# EasyEDA schematic Lab01_2020-10-19_17-25-14.json
TITLE: Sheet_1; REV: 1.0; Date: 2020-10-19; Sheet: 1/1; Company: Your Company
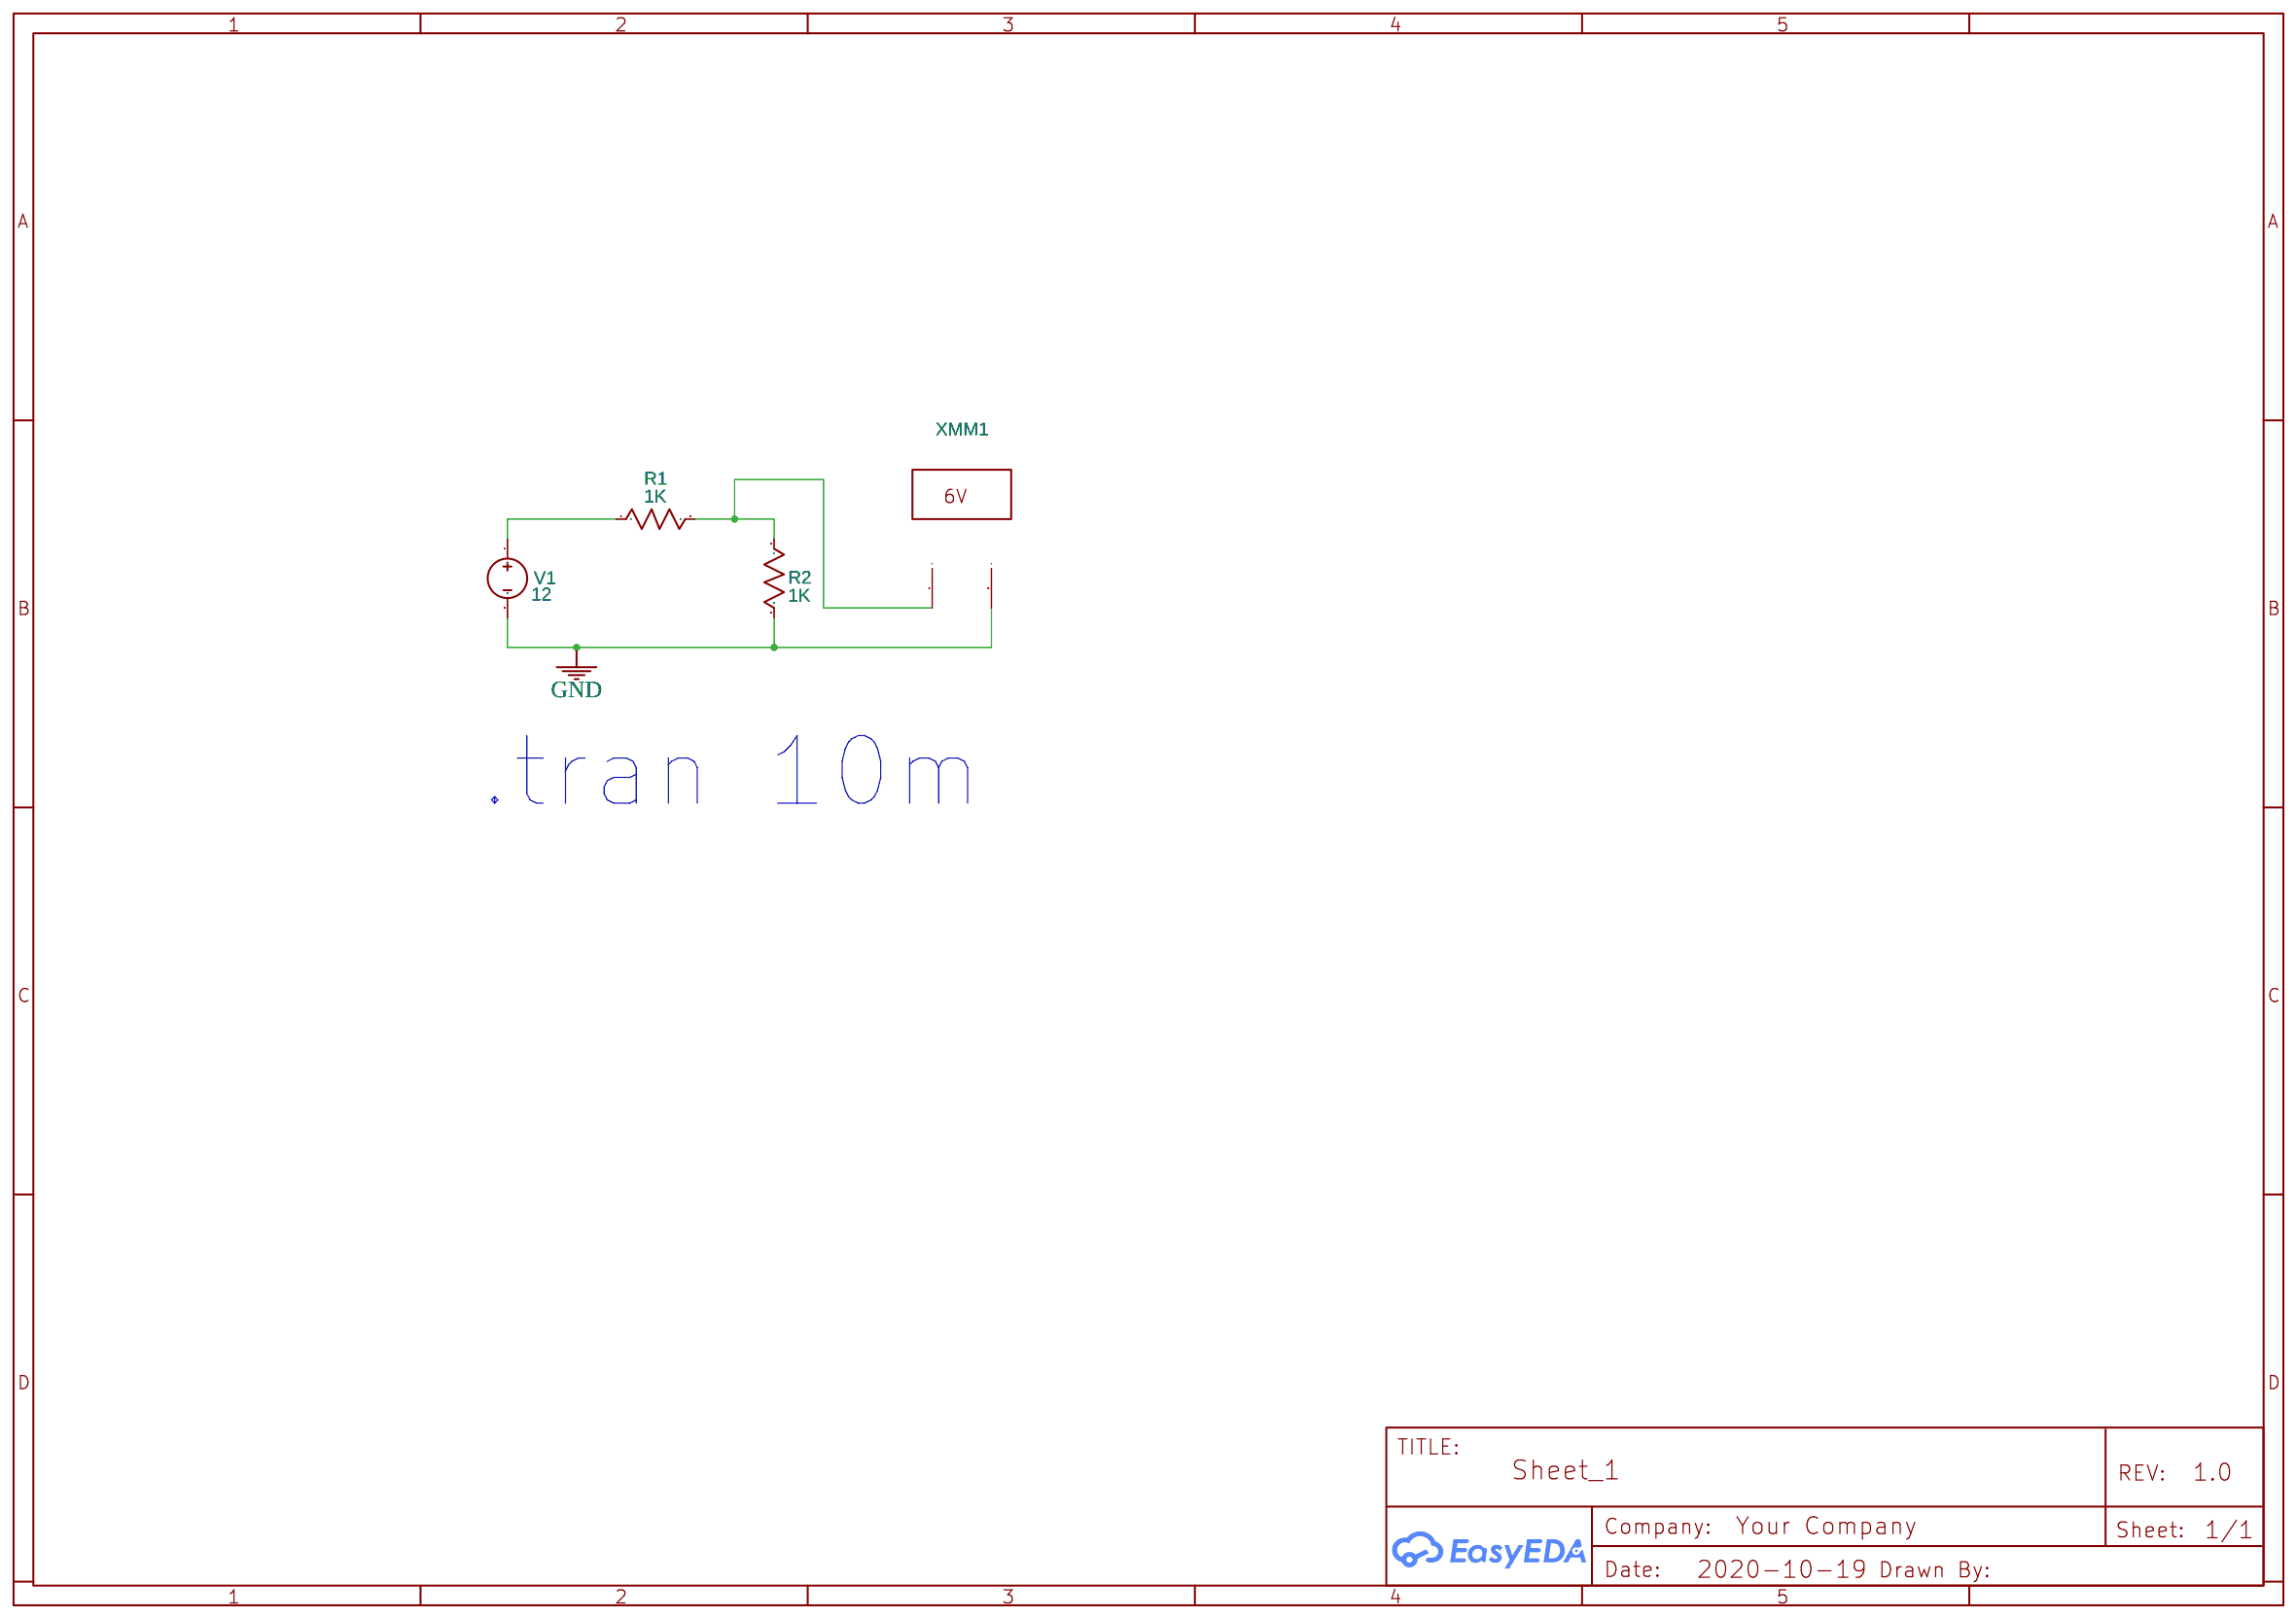
[diagram p0: schematic sheet]

## Parts
R1  1K  [AXIAL-0.3]
R2  1K  [AXIAL-0.3]
V1  12  [HDR1X2]
XMM1  Multimeter

## Library data of the parts
R1 R2 = Resistor_US: Resistance: 1k; Contributor: EasyEDA; Supplier: YUJING
V1 = VDC: Contributor: EasyEDA; sim: true
XMM1 = MULTIMETER: Supplier: LCSC; Multimeter Type: Volt; Power Type: AC; Voltmeter resistance: 10μ; Ammeter resistance: 1G; NameDisplay: 0; Contributor: EasyEDA; sim: true

## Nets
GND: R2.2 V1.2 XMM1.2(I)
Net-(R1-1): R1.1 V1.1
Net-(R1-2): R1.2 R2.1 XMM1.1(+)

## Notes on the sheet
- .tran 10m
